# Altium project 220V转5V.PrjPcb
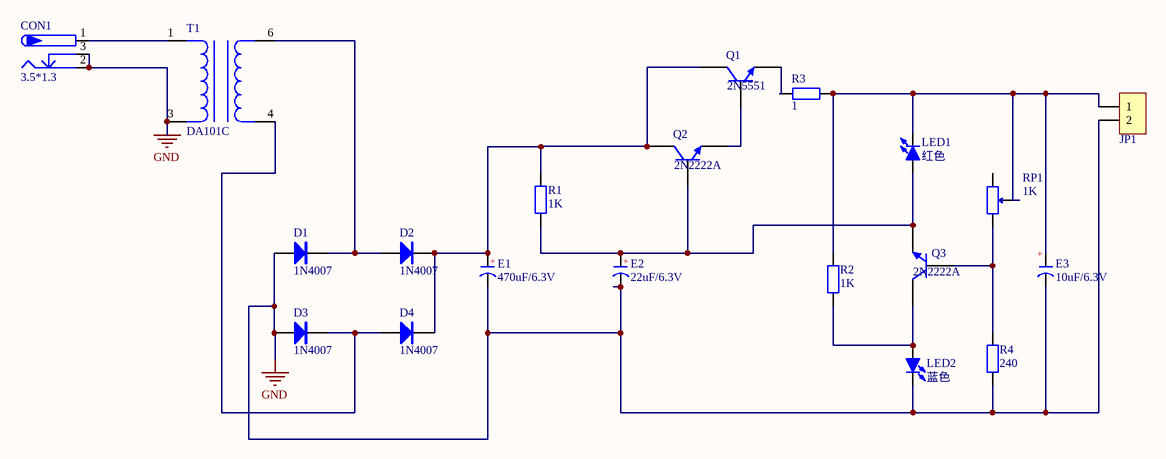
[diagram p0: Sheet1.SchDoc]
1 sheet, 20 parts. Net scope: global (net labels, ports and power ports of the same name join across sheets).
Board file: PCB1.PcbDoc

## Sheet Sheet1.SchDoc
size A4

### Parts
CON1  3.5*1.3  [DC-005]
D1  1N4007  [DO-41]
D2  1N4007  [DO-41]
D3  1N4007  [DO-41]
D4  1N4007  [DO-41]
E1  470uF/6.3V  [CS 2.5*6.3*11 - C]
E2  22uF/6.3V  [CS 2.0*5*8 - C]
E3  10uF/6.3V  [CS 2.0*5*8 - C]
JP1  HDR-1X2  [VH3.96-LI-2P]  (value not drawn)
LED1  红色  [LED 0805R]
LED2  蓝色  [LED 0805B]
Q1  2N5551  [TO-92A]
Q2  2N2222A  [TO-92A]
Q3  2N2222A  [TO-92A]
R1  1K  [R 0805_L]
R2  1K  [R 0805_L]
R3  1  [R 0805_L]
R4  240  [R 0805_L]
RP1  1K  [3296W]
T1  DA101C  [DA10XC]

### Nets
GND: CON1.2 CON1.3 D1.1(A) D3.1(A) E1.2(K) E2.2(K) E3.2(K) JP1.2 LED2.2(K) R4.1 T1.3
NetCON1_1: CON1.1 T1.1
NetD1_2: D1.2(K) D2.1(A) T1.6
NetD2_2: D2.2(K) D4.2(K) E1.1(A) Q1.3(C) Q2.3(C) R1.2
NetD3_2: D3.2(K) D4.1(A) T1.4
NetE2_1: E2.1(A) LED1.1(A) Q2.2(B) Q3.1(E) R1.1
NetE3_1: E3.1(A) JP1.1 LED1.2(K) R2.2 R3.2 RP1.2
NetLED2_1: LED2.1(A) Q3.3(C) R2.1
NetQ1_1: Q1.1(E) R3.1
NetQ1_2: Q1.2(B) Q2.1(E)
NetQ3_2: Q3.2(B) R4.2 RP1.3

Not connected (* = marked no-connect by the designer): RP1 1

### Notes on the sheet
- (in symbol C-CS) +

### Library data of the parts
CON1 = P-DC: 低压电源接口; BOM名称: DC电源接口; 版权归属: 源创客; 学习资源: www.ooocke.com
D1-D4 = 1N4007: 整流二极管; 版权归属: 源创客; BOM名称: 整流二极管; 学习资源: www.ooocke.com
E1-E3 = C-CS: 直插固态电容; 版权归属: 源创客; BOM名称: 直插固态电容; 学习资源: www.ooocke.com
JP1 = Header 2: 2P接插件; 版权归属: 源创客; BOM名称: 2P接插件; 学习资源: www.ooocke.com
LED1 LED2 = LED-SMD: 贴片LED; 版权归属: 源创客; BOM名称: 贴片LED; 学习资源: www.ooocke.com
Q1-Q3 = 2N3904: NPN General Purpose Amplifier; Published: 8-Jun-2000; LatestRevisionDate: 15-Jan-2003; LatestRevisionNote: PCB Footprint 'BCY-W3/D4.7' replaced; DatasheetVersion: 1997; PackageVersion: Sep-1998; PackageReference: TO-92A; Publisher: Altium Limited; PackageDescription: TO, Flat Index; 3 In-Line, Axial Leads; Body Dia. 4.5mm; Leads 0.51 x 0.48 mm (max); ComponentLink1Description: Manufacturer Link; ComponentLink1URL: http://www.fairchildsemi.com/; ComponentLink2Description: Datasheet; ComponentLink2URL: http://www.fairchildsemi.com/ds/2N%2F2N3904.pdf
R1-R4 = R: 贴片电阻; 版权归属: 源创客; BOM名称: 贴片电阻; 学习资源: www.ooocke.com
RP1 = RP: 单联电位器; BOM名称: 插件电位器; 联系卖家，免费查找封装: 唯一出售店铺网址https://shop463601444.taobao.com; 封装库来自淘宝卖家ID：黄晶宝石: 其他店铺购入均为盗版假冒封装库，请立即申请退款
T1 = DA10XC: 数字隔离变压器; 版权归属: 源创客; ROM名称: 数字隔离变压器; 学习资源: www.ooocke.com